# Altium schematic sheet industrial_controller.SchDoc
size A4; DocumentNumber: 1; SheetNumber: 1; SheetTotal: 10
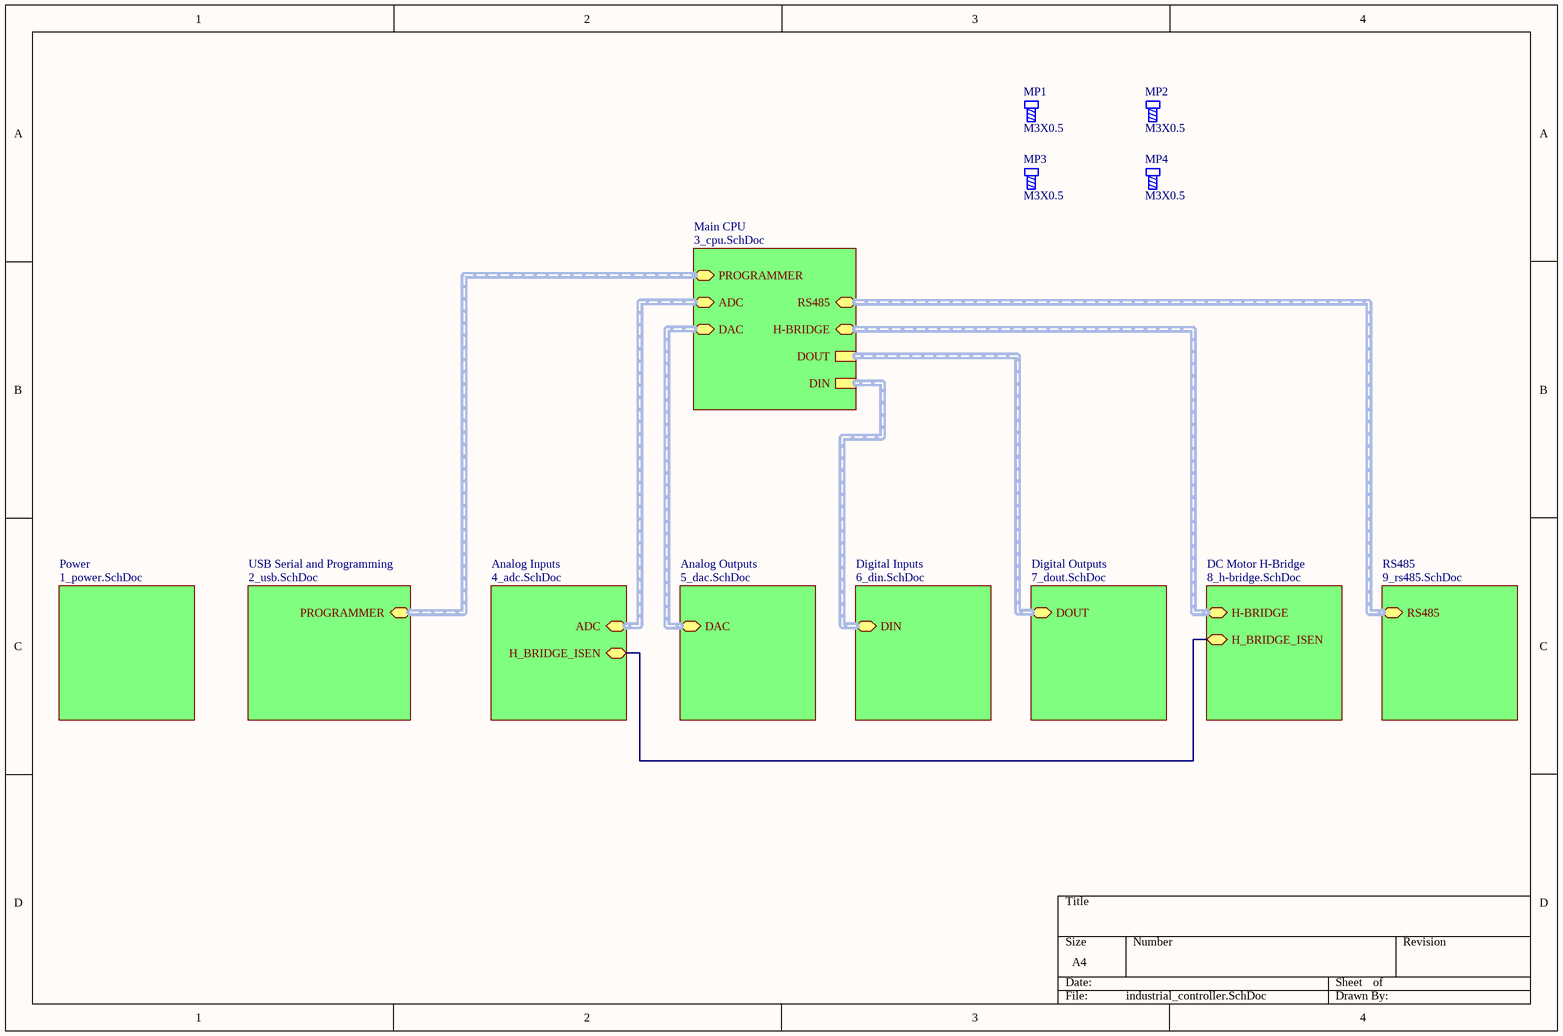
[diagram p0: industrial_controller.SchDoc]

## Parts
MP1  M3X0.5  [SCREW-M3]  (no BOM)
MP2  M3X0.5  [SCREW-M3]  (no BOM)
MP3  M3X0.5  [SCREW-M3]  (no BOM)
MP4  M3X0.5  [SCREW-M3]  (no BOM)

## Sub-sheets
Analog Inputs = 4_adc.SchDoc: ADC (bidir, harness ADC), H_BRIDGE_ISEN (bidir)
Analog Outputs = 5_dac.SchDoc: DAC (bidir, harness DAC)
DC Motor H-Bridge = 8_h-bridge.SchDoc: H-BRIDGE (bidir, harness DC Motor H-Bridge), H_BRIDGE_ISEN (bidir)
Digital Inputs = 6_din.SchDoc: DIN (bidir, harness Digital Inputs)
Digital Outputs = 7_dout.SchDoc: DOUT (bidir, harness Digital Outputs)
Main CPU = 3_cpu.SchDoc: PROGRAMMER (bidir, harness ESP32 Programmer), RS485 (bidir, harness RS485), DAC (bidir, harness DAC), ADC (bidir, harness ADC), H-BRIDGE (bidir, harness DC Motor H-Bridge), DOUT (harness Digital Outputs), DIN (harness Digital Inputs)
Power = 1_power.SchDoc: no entries
RS485 = 9_rs485.SchDoc: RS485 (bidir, harness RS485)
USB Serial and Programming = 2_usb.SchDoc: PROGRAMMER (bidir, harness ESP32 Programmer)

## Nets
(unnamed): sheet Analog Inputs/H_BRIDGE_ISEN, sheet DC Motor H-Bridge/H_BRIDGE_ISEN

## Buses and harness runs
harness sheet Analog Inputs/ADC = sheet Main CPU/ADC
harness sheet Analog Outputs/DAC = sheet Main CPU/DAC
harness sheet DC Motor H-Bridge/H-BRIDGE = sheet Main CPU/H-BRIDGE
harness sheet Digital Inputs/DIN = sheet Main CPU/DIN
harness sheet Digital Outputs/DOUT = sheet Main CPU/DOUT
harness sheet Main CPU/PROGRAMMER = sheet USB Serial and Programming/PROGRAMMER
harness sheet Main CPU/RS485 = sheet RS485/RS485

## Library data of the parts
MP1-MP4 = SCREW-M3: Mach screw M3X0.5; Category: Accesories